# EasyEDA Pro project Big-Button.eprj

# Board PCB1
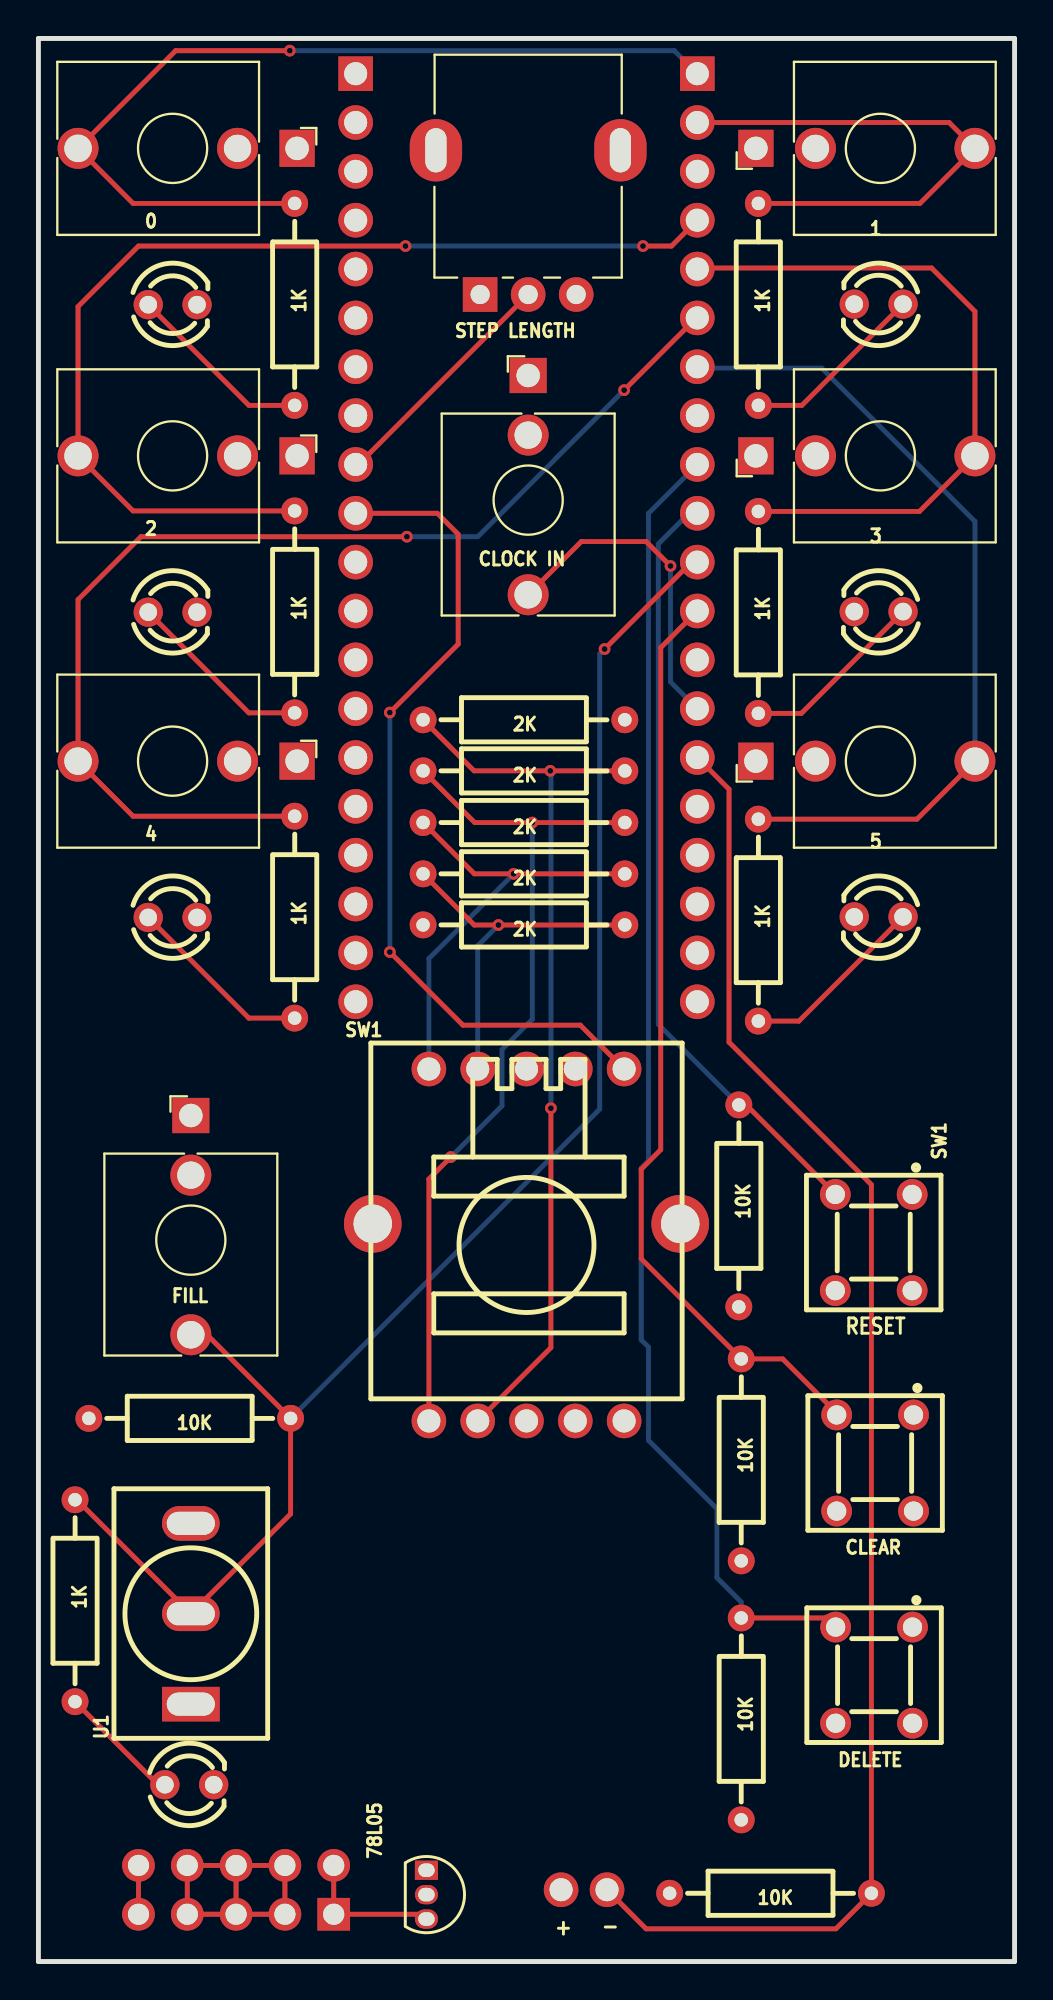
[diagram p0: board, top side]
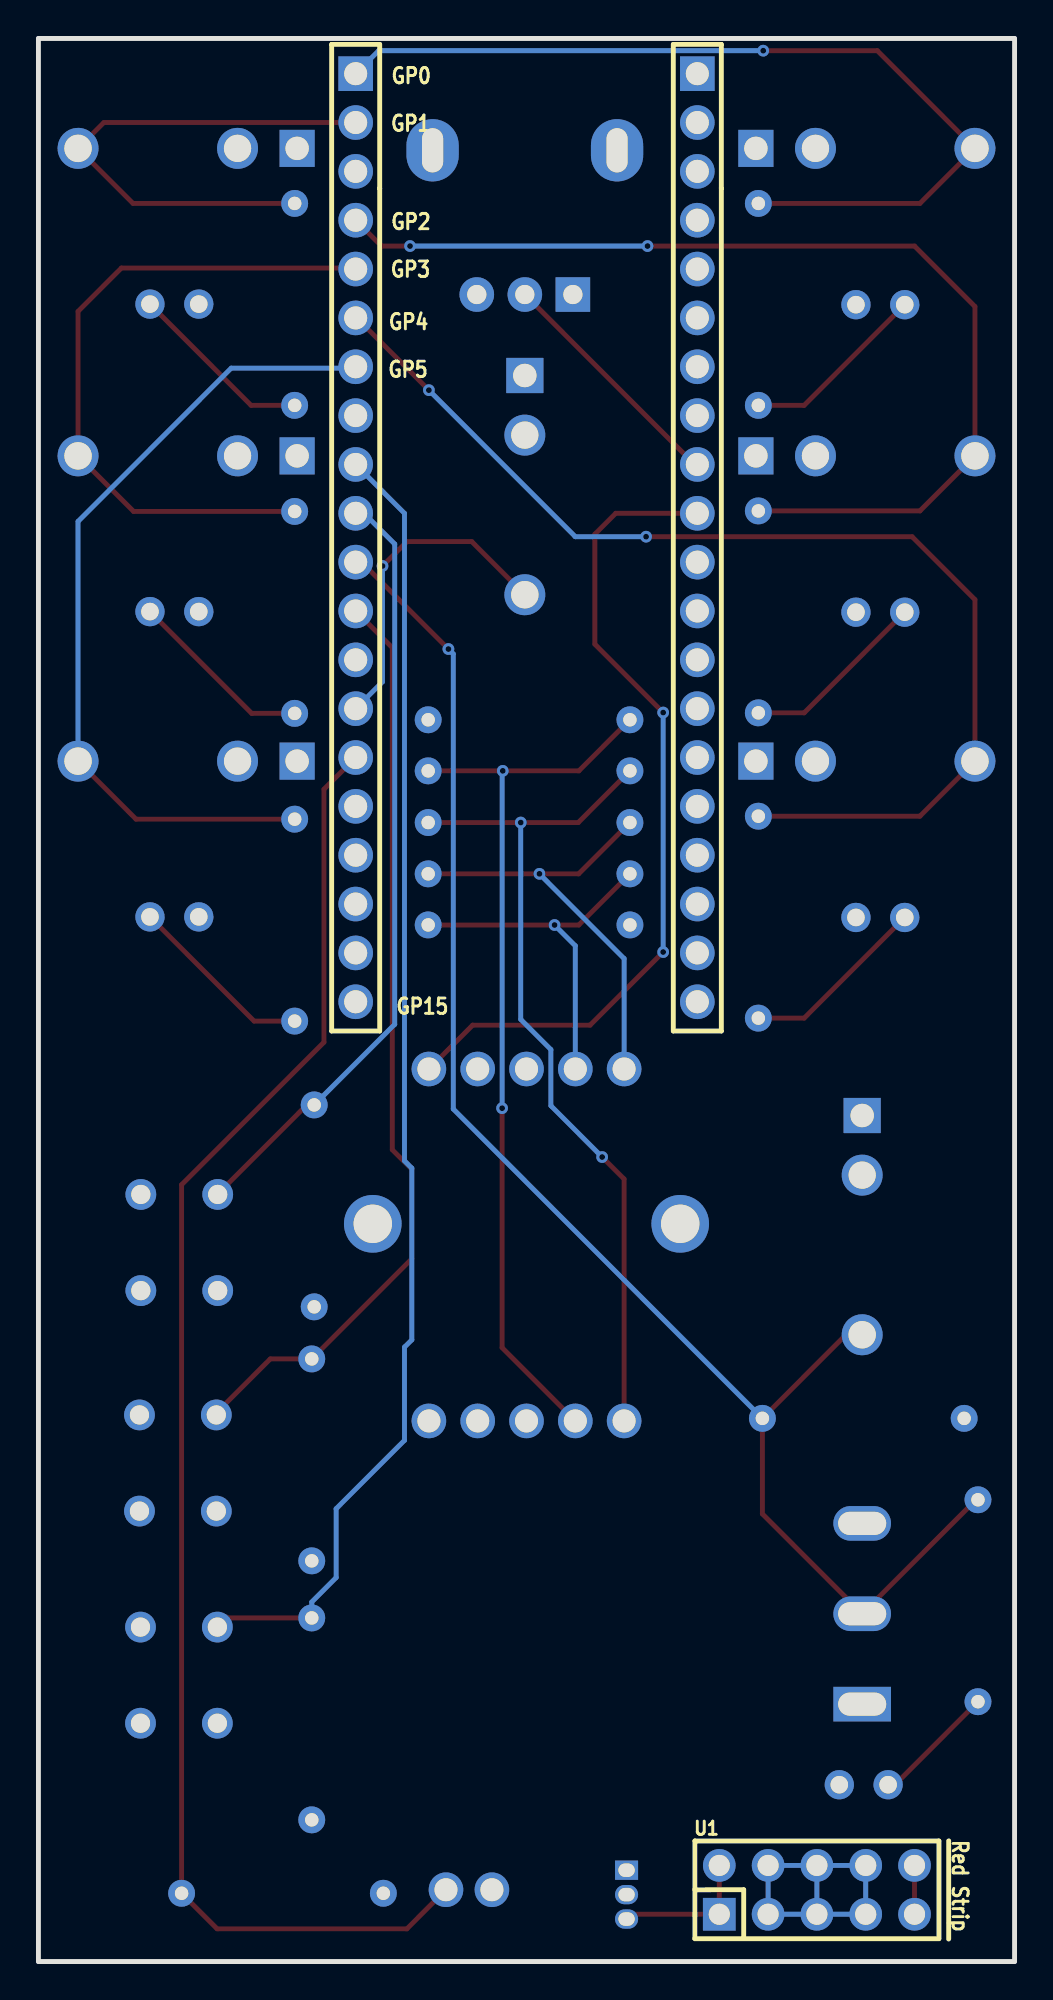
[diagram p1: board, bottom side, seen from below]

Outline 50.8 x 100 mm; copper layers: Top Layer, Bottom Layer. Coordinates in mm from the lower left corner of the outline.
Outline path: 0,100 0,0 50.8,0 50.8,100 0,100
Stack: Top Layer 0.035mm / Dielectric1 1.51mm FR4 er 4.5 / Bottom Layer 0.035mm

## Design rules (mm)
template: JLCPCB Capability(Two Layers Board)
spacing copperThickness1oz (default): track to track 0.102, other pairs 0.152 to 0.3
spacing copperThickness2oz: track to track 0.203, other pairs 0.152 to 0.3
track width copperThickness1oz (default): min 0.127, default 0.254, max 2.54
track width copperThickness2oz: min 0.203, default 0.254, max 2.54
differential pair differentialPair (default): width min 0.127, default 0.254, max 2.54; gap min 0.152, default 0.152
via viaSize (default): diameter min 0.5, default 0.61, max 10; hole min 0.3, default 0.305, max 6.3

## Placement (name value [footprint] x y rotation side)
0  -  [benjiaomodular:AudioJack_3.5mm]  13.46 94.28 270 top
1  -  [benjiaomodular:AudioJack_3.5mm]  37.34 94.28 90 top
1K  -  [RES-TH_BD2.3-L6.5-P10.50-D0.5]  13.34 86.17 90 top
1K#2  -  [RES-TH_BD2.3-L6.5-P10.50-D0.5]  37.47 86.17 90 top
1K#3  -  [RES-TH_BD2.3-L6.5-P10.50-D0.5]  13.34 70.18 90 top
1K#4  -  [RES-TH_BD2.3-L6.5-P10.50-D0.5]  37.47 70.16 90 top
1K#5  -  [RES-TH_BD2.3-L6.5-P10.50-D0.5]  13.34 54.31 90 top
1K#6  -  [RES-TH_BD2.3-L6.5-P10.50-D0.5]  37.47 54.15 90 top
1K#7  -  [RES-TH_BD2.3-L6.5-P10.50-D0.5]  1.91 18.76 90 top
2  -  [benjiaomodular:AudioJack_3.5mm]  13.46 78.3 270 top
2K  -  [RES-TH_BD2.3-L6.5-P10.50-D0.5]  25.27 59.23 0 top
2K#2  -  [RES-TH_BD2.3-L6.5-P10.50-D0.5]  25.27 56.56 0 top
2K#3  -  [RES-TH_BD2.3-L6.5-P10.50-D0.5]  25.27 53.9 0 top
2K#4  -  [RES-TH_BD2.3-L6.5-P10.50-D0.5]  25.27 61.92 0 top
2K#5  -  [RES-TH_BD2.3-L6.5-P10.50-D0.5]  25.27 64.57 0 top
3  -  [benjiaomodular:AudioJack_3.5mm]  37.34 78.3 90 top
4  -  [benjiaomodular:AudioJack_3.5mm]  13.46 62.42 270 top
5  -  [benjiaomodular:AudioJack_3.5mm]  37.34 62.42 90 top
10K  -  [RES-TH_BD2.3-L6.5-P10.50-D0.5]  38.1 3.55 0 top
10K#2  -  [RES-TH_BD2.3-L6.5-P10.50-D0.5]  7.87 28.25 0 top
10K#3  -  [RES-TH_BD2.3-L6.5-P10.50-D0.5]  36.45 39.29 90 top
10K#4  -  [RES-TH_BD2.3-L6.5-P10.50-D0.5]  36.58 26.09 90 top
10K#5  -  [RES-TH_BD2.3-L6.5-P10.50-D0.5]  36.58 12.62 90 top
78L05  BC558  [TO-92-3_L4.5-W3.5-P1.27-L]  20.19 3.48 270 top
CLEAR  BTSA-N-P-13  [SW-TH_BTSA-X-P-13]  43.54 25.92 270 top
CLOCK IN  -  [benjiaomodular:AudioJack_3.5mm]  25.49 82.47 0 top
DELETE  BTSA-N-P-13  [SW-TH_BTSA-X-P-13]  43.49 14.89 270 top
FILL  -  [benjiaomodular:AudioJack_3.5mm]  7.93 43.99 0 top
H2  -  [HDR-TH_20P-P2.54-V-F]  34.29 74.04 270 bottom
H2#2  -  [HDR-TH_20P-P2.54-V-F]  16.51 74.04 270 bottom
LED1  -  [LED-TH_BD3.0-P2.54-FD]  43.73 70.2 180 top
LED1#2  -  [LED-TH_BD3.0-P2.54-FD]  6.98 70.17 0 top
LED1#3  -  [LED-TH_BD3.0-P2.54-FD]  43.73 54.32 180 top
LED1#4  -  [LED-TH_BD3.0-P2.54-FD]  6.98 54.29 0 top
LED1#5  -  [LED-TH_BD3.0-P2.54-FD]  6.98 86.16 0 top
LED1#6  -  [LED-TH_BD3.0-P2.54-FD]  43.73 86.19 180 top
LED1#7  -  [LED-TH_BD3.0-P2.54-FD]  7.85 9.19 0 top
NOREF  -  [Pad_e453]  27.2 3.73 270 top
NOREF#2  -  [Pad_e454]  29.59 3.73 270 top
STEP LENGTH  -  [benjiaomodular:Potentiometer_RV09]  22.99 86.69 90 top
SW1  -  [SW-TH_SRBV151102]  25.4 37.26 0 top
SW1#2  -  [SW-TH_BTSA-X-P-13]  43.47 37.39 270 top
U1  -  [SW-TH_MT-0-103-A101-M200-RS]  7.93 18.09 90 top
U1#2  -  [HDR-TH_10P-P2.54-V-M-R2-C5-S2.54]  10.29 3.73 180 bottom

## Footprints (pads in the part's own frame, mm; a bottom-side part is the same pattern mirrored in y, then rotated)
benjiaomodular:AudioJack_3.5mm
  rect 1.93x1.83 hole 1.22: S(0,0)
  round 2.13 hole 1.43: T(0,-11.4)
  round 2.13 hole 1.42: TN(0,-3.1)
benjiaomodular:Potentiometer_RV09
  rect 1.8x1.8 hole 1: 1(0,0)
  round 1.8 hole 1: 2(0,-2.5) 3(0,-5)
  oval 3.24x2.72 hole 2.3x1.1: 4(7.5,-7.3) 5(7.5,2.3)
HDR-TH_10P-P2.54-V-M-R2-C5-S2.54
  rect 1.7x1.7 hole 1.1: 1(-5.08,-1.27)
  round 1.7 hole 1.1: 2(-5.08,1.27) 3(-2.54,-1.27) 4(-2.54,1.27) 5(0,-1.27) 6(0,1.27) 7(2.54,-1.27) 8(2.54,1.27) 9(5.08,-1.27) 10(5.08,1.27)
HDR-TH_20P-P2.54-V-F
  rect 1.8x1.8 hole 1.2: 1(-24.13,0)
  round 1.8 hole 1.2: 2(-21.59,0) 3(-19.05,0) 4(-16.51,0) 5(-13.97,0) 6(-11.43,0) 7(-8.89,0) 8(-6.35,0) 9(-3.81,0) 10(-1.27,0) 11(1.27,0) 12(3.81,0) 13(6.35,0) 14(8.89,0) 15(11.43,0) 16(13.97,0) 17(16.51,0) 18(19.05,0) 19(21.59,0) 20(24.13,0)
LED-TH_BD3.0-P2.54-FD
  round 1.524 hole 0.914: 1(-1.27,0) 2(1.27,0)
Pad_e453
  round 1.8 hole 1.2: 3(0,0)
Pad_e454
  round 1.8 hole 1.2: 4(0,0)
RES-TH_BD2.3-L6.5-P10.50-D0.5
  round 1.4 hole 0.7: 1(-5.25,0) 2(5.25,0)
SW-TH_BTSA-X-P-13
  round 1.6 hole 1: 1(-2.5,2) 2(-2.5,-2) 3(2.5,2) 4(2.5,-2)
SW-TH_MT-0-103-A101-M200-RS
  rect 1.8x3 hole 1.2x2.5: 1(-4.7,0)
  oval 1.8x3 hole 1.2x2.5: 2(0,0) 3(4.7,0)
SW-TH_SRBV151102
  round 1.8 hole 1.2: 1(5.08,-9.15) 2(2.54,-9.15) 3(0,-9.15) 4(-2.54,-9.15) 5(-5.08,-9.15) 6(-5.08,9.15) 7(-2.54,9.15) 8(0,9.15) 9(2.54,9.15) 10(5.08,9.15)
  round 3 hole 2: 11(8,1.1) 12(-8,1.1)
TO-92-3_L4.5-W3.5-P1.27-L
  rect 1x1.2 hole 0.7x0.85: 1(-1.27,0)
  oval 1x1.2 hole 0.7x0.85: 2(0,0) 3(1.27,0)

## Nets
GND: 0.S 1.S 2.S 2K#5.2 3.S 4.S 5.S 10K.1 10K#2.1 10K#3.1 10K#4.1 10K#5.1 78L05.2 CLOCK IN.S FILL.S H2.3 H2.8 H2.13 H2.18 H2#2.3 H2#2.8 H2#2.13 H2#2.18 LED1.2 LED1#2.2 LED1#3.2 LED1#4.2 LED1#5.2 LED1#6.2 LED1#7.2 STEP LENGTH.3 SW1.3 U1#2.3 U1#2.4 U1#2.5 U1#2.6 U1#2.7 U1#2.8
4: 2K#4.2 2K#5.1 SW1.4
5: 2K.2 2K#4.1 SW1.5
6: 2K.1 2K#2.2 SW1.6
7: 2K#2.1 2K#3.2 SW1.7
+5: 2K#3.1 78L05.1 CLEAR.1 DELETE.1 NOREF.3 STEP LENGTH.1 SW1.8 SW1#2.1 U1.3
+12: 78L05.3 U1#2.1 U1#2.2
-12: U1#2.9 U1#2.10
GP0: 0.T 1K.2 H2.1
GP1: 1.T 1K#2.2 H2.2
GP2: 1K#3.2 2.T H2.4
GP3: 1K#4.2 3.T H2.5
GP4: 1K#5.2 4.T H2.6
GP5: 1K#6.2 5.T H2.7
GP6: 10K#5.2 DELETE.2 H2.9
GP7: 10K#3.2 H2.10 SW1#2.2
GP8: 1K#7.2 10K#2.2 FILL.T H2.11 U1.2
GP9: 10K#4.2 CLEAR.2 H2.12
GP10: CLOCK IN.T H2.14
GP11: 10K.2 H2.15 NOREF#2.4
GP26: H2#2.10 SW1.10
GP27: H2#2.9 STEP LENGTH.2

Pads without a net: 0 TN; 1 TN; 1K 1; 1K#2 1; 1K#3 1; 1K#4 1; 1K#5 1; 1K#6 1; 1K#7 1; 2 TN; 3 TN; 4 TN; 5 TN; CLEAR 3 4; CLOCK IN TN; DELETE 3 4; FILL TN; H2 16 17 19 20; H2#2 1 2 4 5 6 7 11 12 14 15 16 17 19 20; LED1 1; LED1#2 1; LED1#3 1; LED1#4 1; LED1#5 1; LED1#6 1; LED1#7 1; STEP LENGTH 4 5; SW1 1 2 9 11 12; SW1#2 3 4; U1 1

## Via types
v1: diameter 0.61, hole 0.305, Top Layer to Bottom Layer, 15 vias

## Routing (per net, layer and track width the routed paths; a pad name or vN(x,y) marks a point on that pad's centre or on a via; arc(x,y) is an arc through that point)
GND: length 35.6
  Top Layer w0.254: U1#2.6 U1#2.5 ; U1#2.6 U1#2.8 U1#2.7 U1#2.5 ; U1#2.6 U1#2.4 U1#2.3 U1#2.5
  Bottom Layer w0.254: U1#2.5 U1#2.6 ; U1#2.5 U1#2.3 U1#2.4 U1#2.6 ; U1#2.5 U1#2.7 U1#2.8 U1#2.6
(no net): length 65
  Top Layer w0.254: 1K#5.1 10.95,49.06 LED1#4.1 ; 1K#6.1 39.58,48.9 LED1#3.1 ; LED1.1 39.7,64.91 1K#4.1 ; 1K#2.1 39.73,80.92 LED1#6.1 ; LED1#2.1 10.95,64.93 1K#3.1 ; LED1#5.1 10.95,80.92 1K.1 ; LED1#7.1 6.22,9.19 1K#7.1
4: length 47
  Top Layer w0.254: SW1.4 26.67,31.92 v1(26.67,44.37) ; 2K#4.2 v1(26.64,61.92) 22.67,61.92 2K#5.1
  Bottom Layer w0.254: v1(26.64,61.92) 26.67,61.88 v1(26.67,44.37)
5: length 45
  Top Layer w0.254: 2K.2 v1(25.7,59.23) 22.71,59.23 2K#4.1 ; v1(21.46,41.83) 20.32,40.69 SW1.5
  Bottom Layer w0.254: v1(25.7,59.23) 25.7,48.99 24.13,47.42 24.13,44.5 v1(21.46,41.83)
6: length 23.6
  Top Layer w0.254: 2K.1 22.68,56.56 v1(24.73,56.56) 2K#2.2
  Bottom Layer w0.254: v1(24.73,56.56) 20.32,52.16 SW1.6
7: length 19.5
  Top Layer w0.254: 2K#3.2 30.51,53.9 v1(23.94,53.9) 22.68,53.9 2K#2.1
  Bottom Layer w0.254: SW1.7 22.86,52.82 v1(23.94,53.9)
+12: length 7.5
  Top Layer w0.254: U1#2.2 U1#2.1 19.94,2.46 78L05.3
-12: length 2.5
  Top Layer w0.254: U1#2.9 U1#2.10
GP0: length 47.3
  Top Layer w0.254: 1K.2 4.92,91.42 0.T 7.14,99.37 v1(13.08,99.37)
  Bottom Layer w0.254: H2.1 33.09,99.37 v1(13.08,99.37)
GP1: length 27.5
  Top Layer w0.254: H2.2 47.39,95.63 1.T 45.88,91.42 1K#2.2
GP2: length 54.3
  Top Layer w0.254: 1K#3.2 4.92,75.43 2.T 2.06,86.06 5.21,89.2 v1(19.1,89.2) ; H2.4 32.95,89.2 v1(31.46,89.2)
  Bottom Layer w0.254: v1(31.46,89.2) v1(19.1,89.2)
GP3: length 35.4
  Top Layer w0.254: 1K#4.2 45.85,75.41 3.T 48.74,85.81 46.48,88.06 34.34,88.06 H2.5
GP4: length 59.2
  Top Layer w0.254: v1(30.48,81.71) 34.24,85.47 H2.6 ; v1(19.18,74.09) 5.33,74.09 2.06,70.82 4.T 4.92,59.56 1K#5.2
  Bottom Layer w0.254: v1(30.48,81.71) 22.86,74.09 v1(19.18,74.09)
GP5: length 42.8
  Top Layer w0.254: 1K#6.2 45.72,59.4 5.T
  Bottom Layer w0.254: 5.T 48.74,74.88 40.77,82.86 34.36,82.86 H2.7
GP6: length 68.5
  Top Layer w0.254: DELETE.2 41.01,17.87 40.99,17.87 ; 40.99,17.87 10K#5.2 ; 40.99,17.87 40.99,17.91
  Bottom Layer w0.254: H2.9 31.75,75.31 31.75,41.64 31.37,41.26 31.37,32.33 31.75,31.95 31.75,27.1 35.31,23.55 35.31,19.96 36.58,18.69 10K#5.2
GP7: length 40.6
  Top Layer w0.254: SW1#2.2 41.47,39.91 36.83,44.54 10K#3.2
  Bottom Layer w0.254: 10K#3.2 32.26,48.73 32.26,73.71 33.86,75.31 H2.10
GP8: length 81.3
  Top Layer w0.254: 1K#7.2 2,24.01 U1.2 13.12,23.28 10K#2.2 8.78,32.59 FILL.T ; H2.11 33.98,72.77 v1(29.46,68.25)
  Bottom Layer w0.254: 10K#2.2 29.21,44.33 29.21,68 v1(29.46,68.25)
GP9: length 48.5
  Top Layer w0.254: CLEAR.2 41.54,28.53 38.73,31.34 10K#4.2 31.37,36.54 31.37,41.2 32.38,42.22 32.38,68.32 H2.12
GP10: length 17.1
  Top Layer w0.254: v1(32.89,72.57) 31.62,73.84 28.25,73.84 CLOCK IN.T
  Bottom Layer w0.254: H2.14 32.89,66.55 v1(32.89,72.57)
GP11: length 78.2
  Top Layer w0.254: NOREF#2.4 31.62,1.7 41.5,1.7 10K.2 43.35,40.39 35.94,47.8 35.94,60.96 34.29,62.61
GP26: length 43.7
  Top Layer w0.254: v1(18.29,64.95) 21.84,68.5 21.84,74.22 20.75,75.31 H2#2.10 ; SW1.10 28.2,48.69 22.09,48.69 v1(18.29,52.49)
  Bottom Layer w0.254: v1(18.29,52.49) v1(18.29,64.95)
GP27: length 12.6
  Top Layer w0.254: STEP LENGTH.2 16.65,77.85 H2#2.9

## Copper pours and planes (outline as drawn; the poured copper is in the pictures)
GND on Top Layer: -0.95,100.89 50.57,100.89 50.57,-0.59 -0.95,-0.59
+5 on Bottom Layer: -0.96,100.81 50.57,100.81 50.57,-1.12 -0.96,-1.12

## Text on the board
Bottom Silkscreen Layer: Red Strip | GP15 | GP0 | GP2 | GP1 | GP3 | GP4 | GP5
Top Silkscreen Layer: + | - | RESET

# Board PCB4
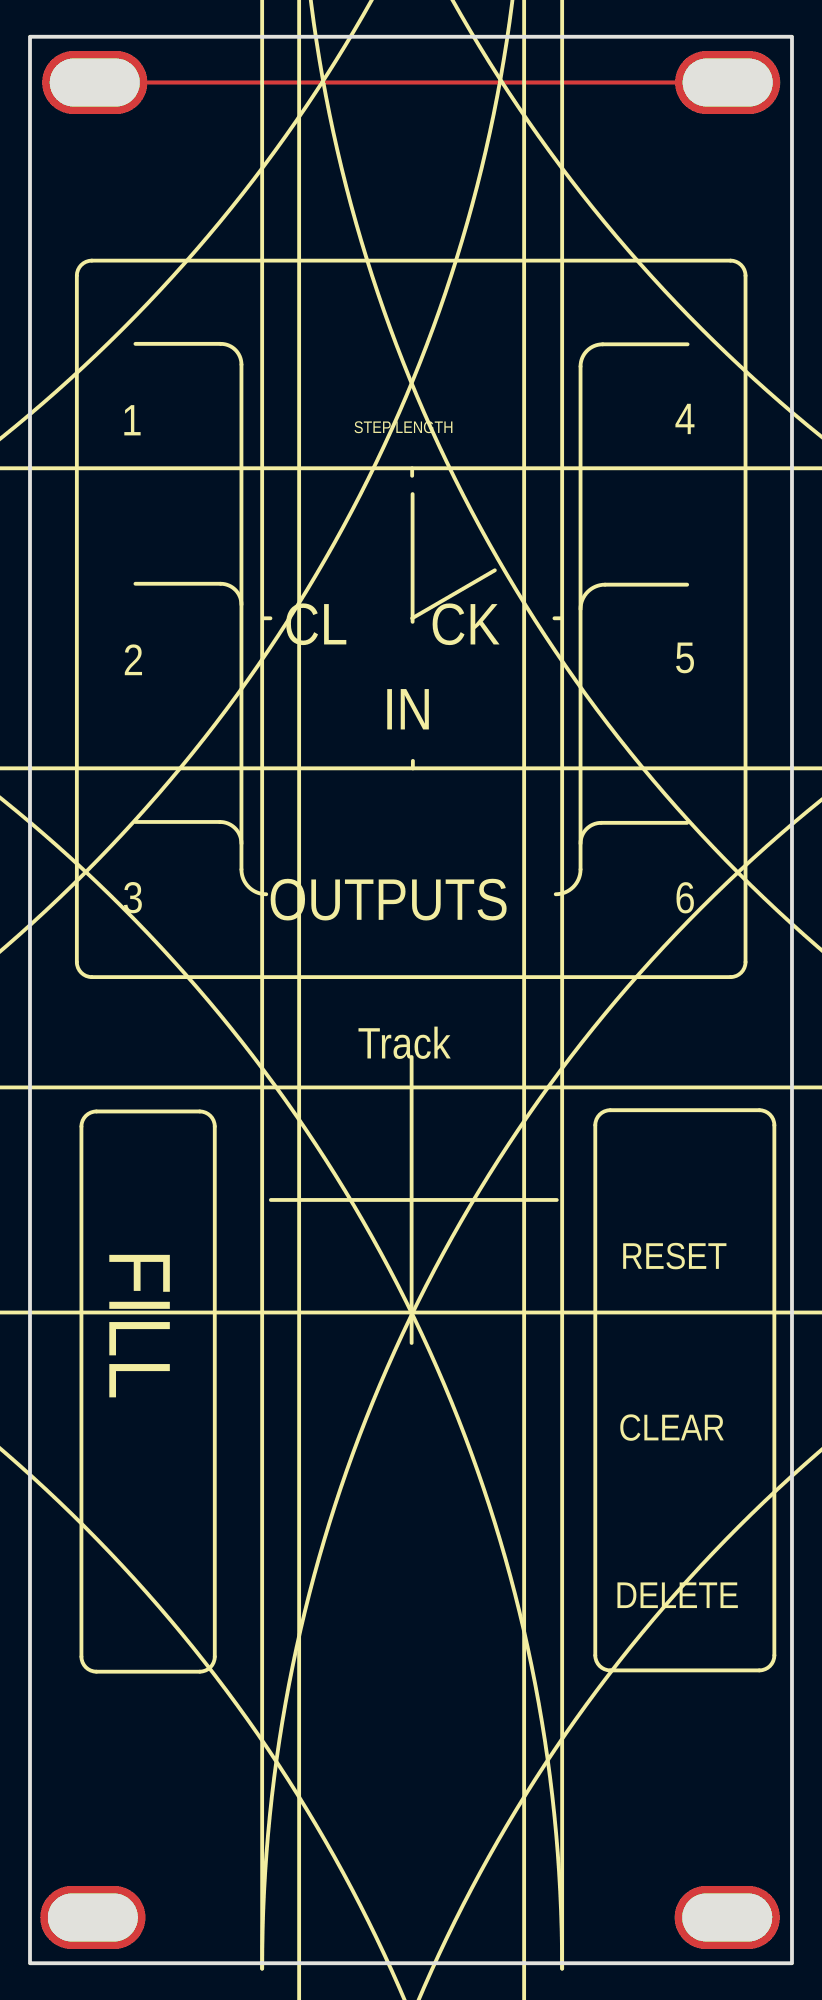
[diagram p2: board, top side]
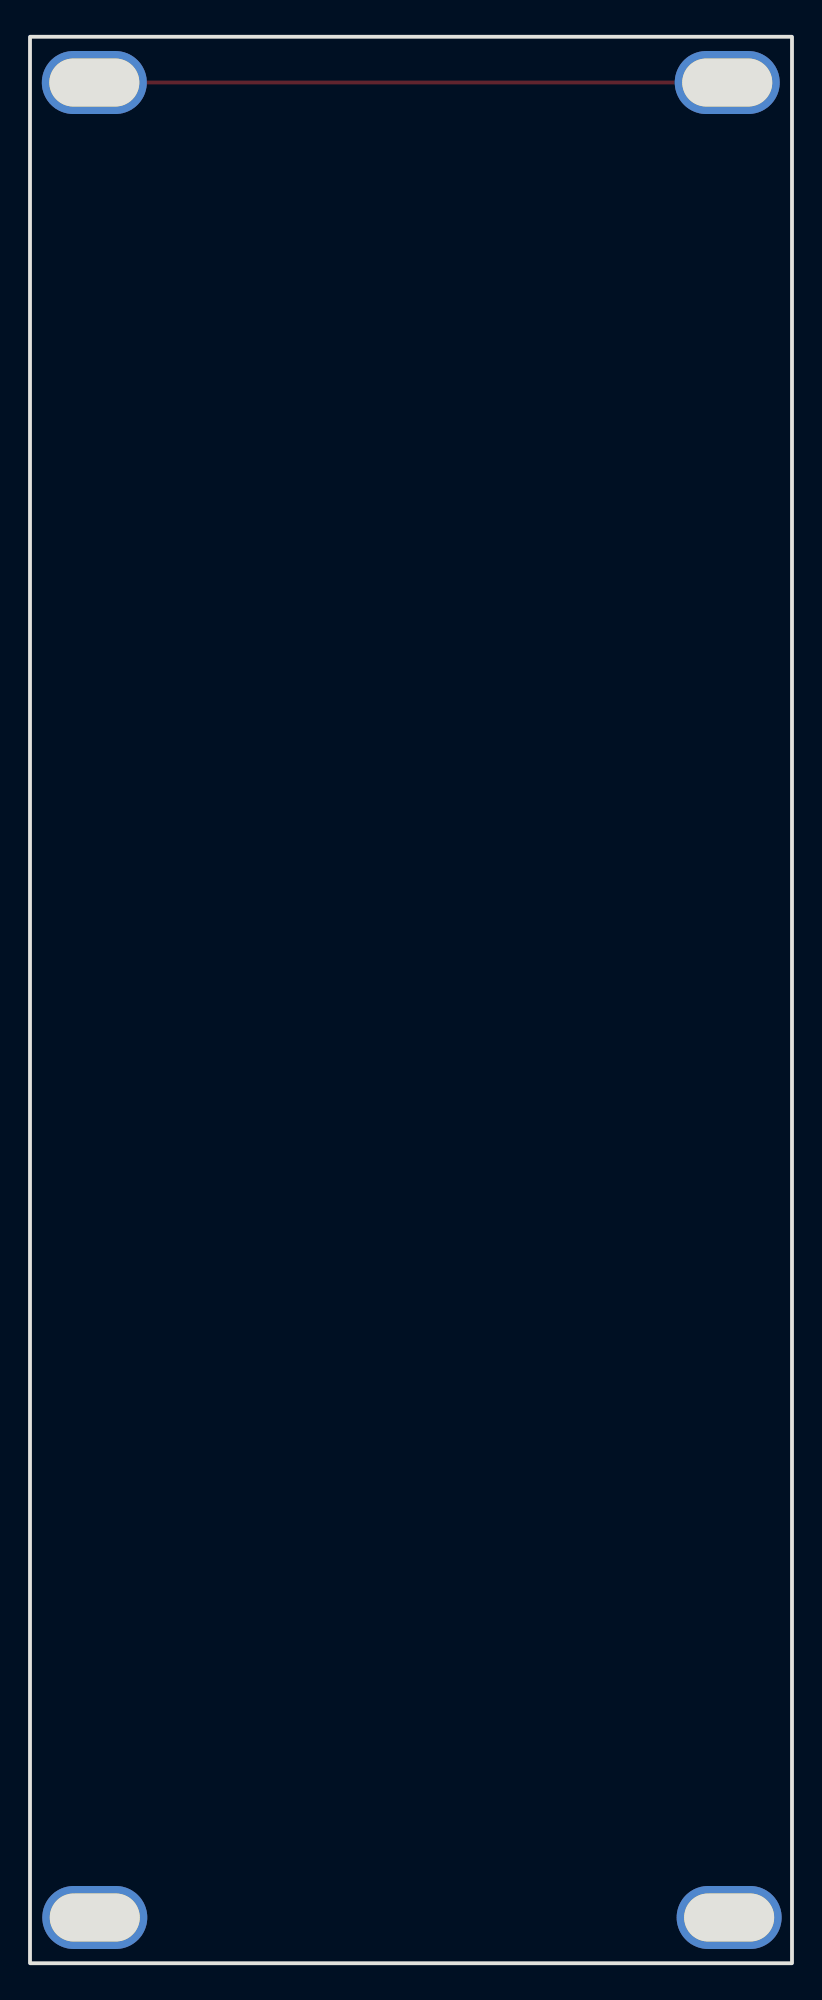
[diagram p3: board, bottom side, seen from below]

Outline 50.8 x 128.4 mm; copper layers: Top Layer, Bottom Layer. Coordinates in mm from the lower left corner of the outline.
Outline path: rectangle 0,128.4 50.8,0
Stack: Top Layer 0.035mm / Dielectric1 1.51mm FR4 er 4.5 / Bottom Layer 0.035mm

## Design rules (mm)
template: JLCPCB Capability(Two Layers Board)
spacing copperThickness1oz (default): track to track 0.102, other pairs 0.152 to 0.3
spacing copperThickness2oz: track to track 0.203, other pairs 0.152 to 0.3
track width copperThickness1oz (default): min 0.127, default 0.254, max 2.54
track width copperThickness2oz: min 0.203, default 0.254, max 2.54
differential pair differentialPair (default): width min 0.127, default 0.254, max 2.54; gap min 0.152, default 0.152
via viaSize (default): diameter min 0.5, default 0.61, max 10; hole min 0.3, default 0.305, max 6.3

## Placement (name value [footprint] x y rotation side)
NOREF  -  [Pad_e27]  4.32 125.35 0 top
NOREF#2  -  [Pad_e20]  46.51 125.35 0 top
NOREF#3  -  [Pad_e26]  46.48 3.05 0 top
NOREF#4  -  [Pad_e30]  4.19 3.05 0 top

## Footprints (pads in the part's own frame, mm; a bottom-side part is the same pattern mirrored in y, then rotated)
Pad_e20
  oval 7x4.2 hole 6x3.2: 17(0,0)
Pad_e26
  oval 7x4.2 hole 6x3.2: 17(0,0)
Pad_e27
  oval 7x4.2 hole 6x3.2: 17(0,0)
Pad_e30
  oval 7x4.2 hole 6x3.2: 17(0,0)

## Nets

Pads without a net: NOREF 17; NOREF#2 17; NOREF#3 17; NOREF#4 17

## Routing (per net, layer and track width the routed paths; a pad name or vN(x,y) marks a point on that pad's centre or on a via; arc(x,y) is an arc through that point)
(no net): length 42.2
  Top Layer w0.254: NOREF.17 NOREF#2.17

## Text on the board
Top Silkscreen Layer: STEP LENGTH | DELETE | CLEAR | RESET | 1 | 3 | 2 | 4 | 5 | 6 | Track | OUTPUTS | CL      CK | IN | FILL
